# Altium schematic sheet Side1.SchDoc
size Letter
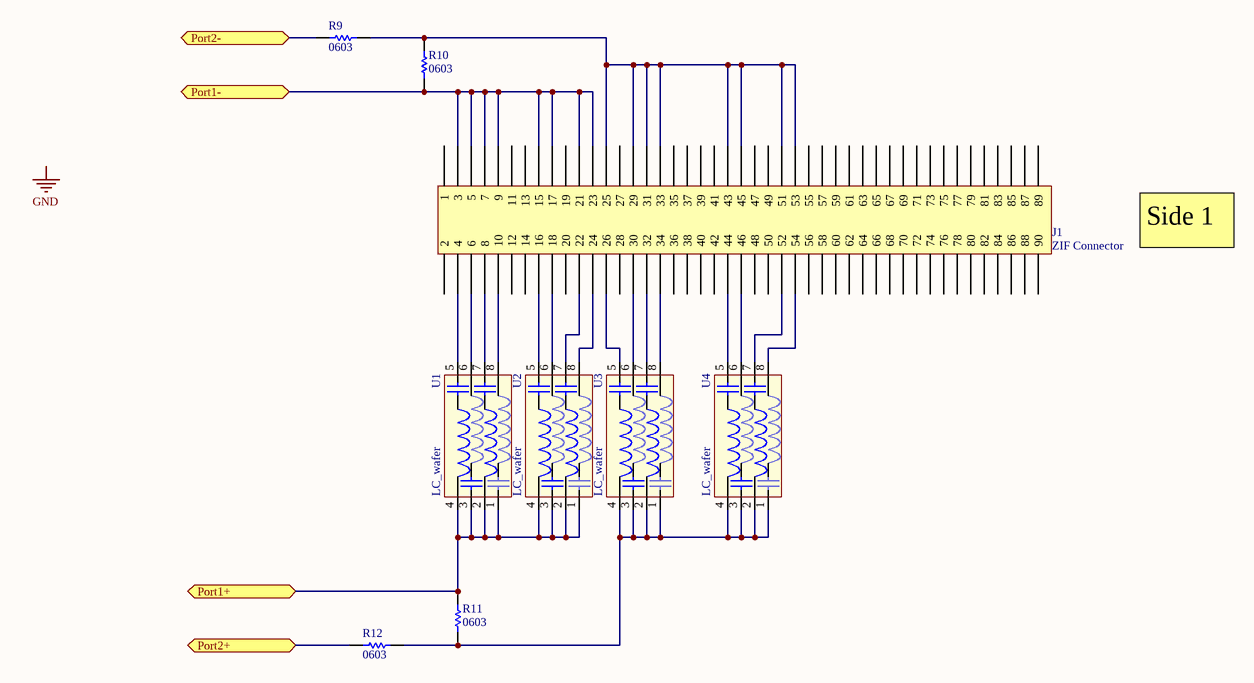
[diagram p0: Side1.SchDoc]

## Parts
J1  ZIF Connector  [LCBoard_ZIFCon]
R9  0603  [0603]
R10  0603  [0603]
R11  0603  [0603]
R12  0603  [0603]
U1  LC_wafer  [LCWafer]
U2  LC_wafer  [LCWafer]
U3  LC_wafer  [LCWafer]
U4  LC_wafer  [LCWafer]

## Ports
Port1+, Port1-, Port2+, Port2-

## Nets
Port1+: R11.2 U1.1 U1.2 U1.3 U1.4 U2.1 U2.2 U2.3 U2.4 ; port Port1+
Port1-: J1.3 J1.5 J1.7 J1.9 J1.15 J1.17 J1.21 J1.23 R10.1 ; port Port1-
Port2+: R12.2 ; port Port2+
Port2-: R9.2 ; port Port2-
NetJ1_4: J1.4 U1.5
NetJ1_6: J1.6 U1.6
NetJ1_8: J1.8 U1.7
NetJ1_10: J1.10 U1.8
NetJ1_16: J1.16 U2.5
NetJ1_18: J1.18 U2.6
NetJ1_22: J1.22 U2.7
NetJ1_24: J1.24 U2.8
NetJ1_25: J1.25 J1.29 J1.31 J1.33 J1.43 J1.45 J1.51 J1.53 R9.1 R10.2
NetJ1_26: J1.26 U3.5
NetJ1_30: J1.30 U3.6
NetJ1_32: J1.32 U3.7
NetJ1_34: J1.34 U3.8
NetJ1_44: J1.44 U4.5
NetJ1_46: J1.46 U4.6
NetJ1_52: J1.52 U4.7
NetJ1_54: J1.54 U4.8
NetR11_1: R11.1 R12.1 U3.1 U3.2 U3.3 U3.4 U4.1 U4.2 U4.3 U4.4

Not connected (* = marked no-connect by the designer): J1 1 2 11 12 13 14 19 20 27 28 35 36 37 38 39 40 41 42 47 48 49 50 55 56 57 58 59 60 61 62 63 64 65 66 67 68 69 70 71 72 73 74 75 76 77 78 79 80 81 82 83 84 85 86 87 88 89 90

## Notes on the sheet
- Side 1
- Labels drawn without touching a wire or pin: GND

## Library data of the parts
J1 = LCboard_FH16-90S-0.3SHW(05)
R9-R12 = Res0603: RES 1 OHM 1/10W 1% 0603 SMD; Value: 1; TechInfo: *
U1-U4 = LCWafer: Gold bonded integrated LC